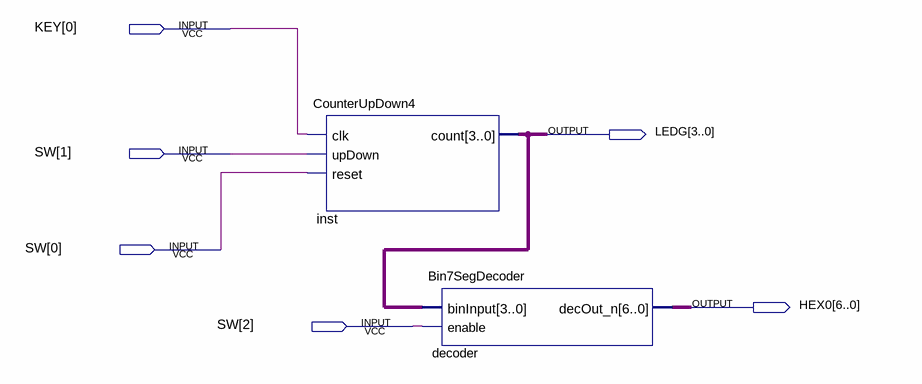
[diagram p0: schematic sheet]
// Quartus schematic Counter_Demo.bdf as structural Verilog: 2 symbols, 6 pins
module Counter_Demo (
  input  [0:0] KEY,
  input  [2:0] SW,
  output [3:0] LEDG,
  output [6:0] HEX0
);

  CounterUpDown4 inst (.clk(KEY[0]), .upDown(SW[1]), .reset(SW[0]), .count(LEDG));
  Bin7SegDecoder decoder (.binInput(LEDG), .enable(SW[2]), .decOut_n(HEX0));
endmodule
